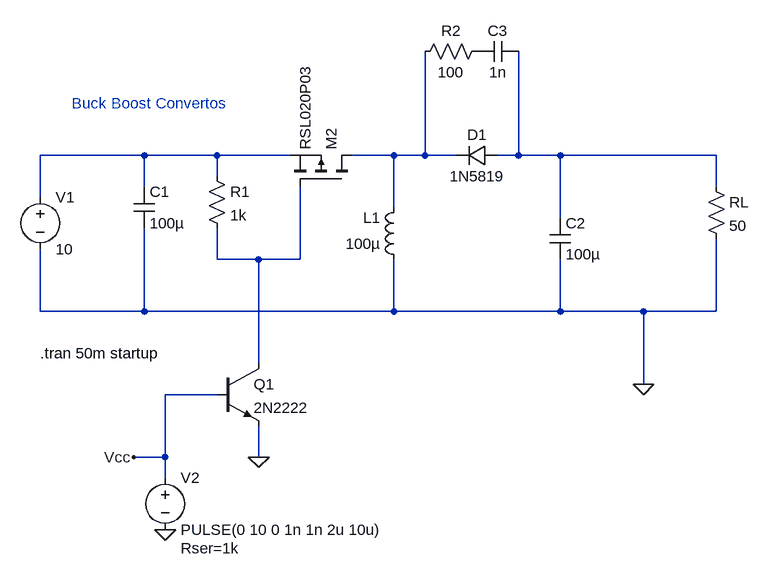
[diagram p0: schematic Buck_Boost_Converter.asc]
Buck_Boost_Converter.asc, the LTspice schematic file:
Version 4.1
SHEET 1 1576 892
WIRE 192 144 32 144
WIRE 304 144 192 144
WIRE 416 144 304 144
WIRE 576 144 512 144
WIRE 624 144 624 -16
WIRE 624 144 576 144
WIRE 672 144 624 144
WIRE 768 144 768 -16
WIRE 768 144 736 144
WIRE 832 144 768 144
WIRE 1072 144 832 144
WIRE 304 176 304 144
WIRE 192 192 192 144
WIRE 1072 192 1072 144
WIRE 32 208 32 144
WIRE 576 224 576 144
WIRE 832 240 832 144
WIRE 304 304 304 256
WIRE 368 304 304 304
WIRE 432 304 432 192
WIRE 432 304 368 304
WIRE 32 384 32 288
WIRE 192 384 192 256
WIRE 192 384 32 384
WIRE 576 384 576 304
WIRE 576 384 192 384
WIRE 832 384 832 304
WIRE 832 384 576 384
WIRE 960 384 832 384
WIRE 1072 384 1072 272
WIRE 1072 384 960 384
WIRE 368 464 368 304
WIRE 960 496 960 384
WIRE 304 512 224 512
WIRE 224 608 224 512
WIRE 224 608 176 608
WIRE 368 608 368 560
WIRE 224 640 224 608
FLAG 960 496 0
FLAG 224 720 0
FLAG 176 608 Vcc
FLAG 368 608 0
SYMBOL voltage 32 192 R0
WINDOW 123 0 0 Left 0
WINDOW 39 0 0 Left 0
SYMATTR InstName V1
SYMATTR Value 10
SYMBOL cap 176 192 R0
SYMATTR InstName C1
SYMATTR Value 100µ
SYMBOL diode 736 128 R90
WINDOW 0 0 32 VBottom 2
WINDOW 3 32 32 VTop 2
SYMATTR InstName D1
SYMATTR Value 1N5819
SYMBOL ind 592 320 R180
WINDOW 0 36 80 Left 2
WINDOW 3 36 40 Left 2
SYMATTR InstName L1
SYMATTR Value 100µ
SYMATTR SpiceLine Rser=1
SYMBOL cap 816 240 R0
SYMATTR InstName C2
SYMATTR Value 100µ
SYMBOL res 1056 176 R0
SYMATTR InstName RL
SYMATTR Value 50
SYMBOL npn 304 464 R0
SYMATTR InstName Q1
SYMATTR Value 2N2222
SYMBOL voltage 224 624 R0
WINDOW 123 0 0 Left 0
WINDOW 39 24 124 Left 2
SYMATTR SpiceLine Rser=1k
SYMATTR InstName V2
SYMATTR Value PULSE(0 10 0 1n 1n 2u 10u)
SYMBOL pmos 512 192 M270
SYMATTR InstName M2
SYMATTR Value RSL020P03
SYMBOL res 608 0 R270
WINDOW 0 32 56 VTop 2
WINDOW 3 0 56 VBottom 2
SYMATTR InstName R2
SYMATTR Value 100
SYMBOL cap 704 0 R270
WINDOW 0 32 32 VTop 2
WINDOW 3 0 32 VBottom 2
SYMATTR InstName C3
SYMATTR Value 1n
SYMBOL res 288 160 R0
SYMATTR InstName R1
SYMATTR Value 1k
TEXT 32 448 Left 2 !.tran 50m startup
TEXT 80 64 Left 2 ;Buck Boost Convertos

The netlist it stands for:
* Buck_Boost_Converter.asc
V1 N001 0 10
C1 N001 0 100µ
D1 N003 N002 1N5819
L1 0 N002 100µ Rser=1
C2 N003 0 100µ
RL N003 0 50
Q1 N004 Vcc 0 0 2N2222
V2 Vcc 0 PULSE(0 10 0 1n 1n 2u 10u) Rser=1k
M2 N002 N004 N001 N001 RSL020P03
R2 N002 P001 100
C3 P001 N003 1n
R1 N001 N004 1k
.model D D
.lib standard.dio
.model NPN NPN
.model PNP PNP
.lib standard.bjt
.model NMOS NMOS
.model PMOS PMOS
.lib standard.mos
.tran 50m startup
* Buck Boost Convertos
.backanno
.end